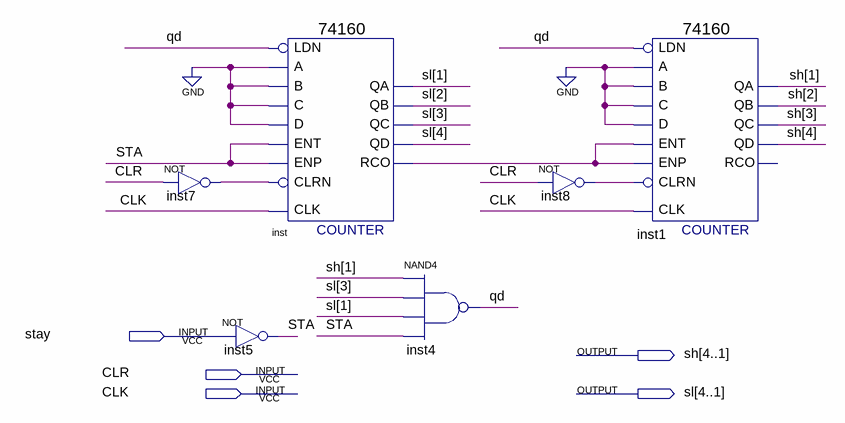
[diagram p0: schematic sheet]
// Quartus schematic mo165.bdf as structural Verilog: 6 symbols, 5 pins
module mo165 (
  input  stay,
  input  CLR,
  input  CLK,
  output [4:1] sh,
  output [4:1] sl
);

  wire inst7_out, inst8_out, inst_rco, qd, STA;

  not inst7 (inst7_out, CLR);
  \74160  inst (
    .CLK(CLK), .ENT(STA), .A(1'b0), .B(1'b0), .C(1'b0), .D(1'b0), .LDN(qd), .ENP(STA), .CLRN(inst7_out),
    .QD(sl[4]), .QA(sl[1]), .QB(sl[2]), .QC(sl[3]), .RCO(inst_rco));
  not inst5 (STA, stay);
  nand inst4 (qd, sh[1], sl[3], sl[1], STA);
  not inst8 (inst8_out, CLR);
  \74160  inst1 (
    .CLK(CLK), .ENT(inst_rco), .A(1'b0), .B(1'b0), .C(1'b0), .D(1'b0), .LDN(qd), .ENP(inst_rco),
    .CLRN(inst8_out), .QD(sh[4]), .QA(sh[1]), .QB(sh[2]), .QC(sh[3]));  // open: RCO
endmodule
